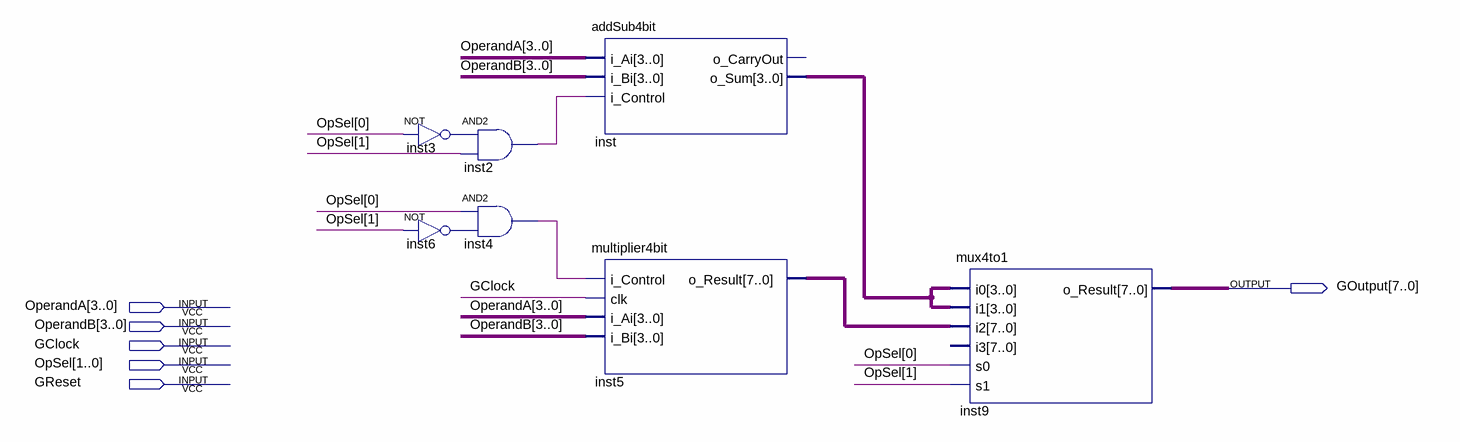
[diagram p0: schematic sheet]
// Quartus schematic lab2.bdf as structural Verilog: 7 symbols, 6 pins
module lab2 (
  input  [3:0] OperandA,
  input  [3:0] OperandB,
  input  GClock,
  input  [1:0] OpSel,
  input  GReset,
  output [7:0] GOutput
);

  wire inst2_out, inst3_out, inst4_out, inst6_out;
  wire [3:0] inst_o_sum;
  wire [7:0] inst5_o_result;

  not inst3 (inst3_out, OpSel[0]);
  not inst6 (inst6_out, OpSel[1]);
  and inst2 (inst2_out, inst3_out, OpSel[1]);
  and inst4 (inst4_out, OpSel[0], inst6_out);
  addSub4bit inst (.i_Ai(OperandA), .i_Bi(OperandB), .i_Control(inst2_out), .o_Sum(inst_o_sum));  // open: o_CarryOut
  multiplier4bit inst5 (
    .i_Control(inst4_out), .clk(GClock), .i_Ai(OperandA), .i_Bi(OperandB), .o_Result(inst5_o_result));
  mux4to1 inst9 (
    .i0(inst_o_sum), .i1(inst_o_sum), .i2(inst5_o_result), .s0(OpSel[0]), .s1(OpSel[1]), .o_Result(GOutput));  // open: i3
endmodule
